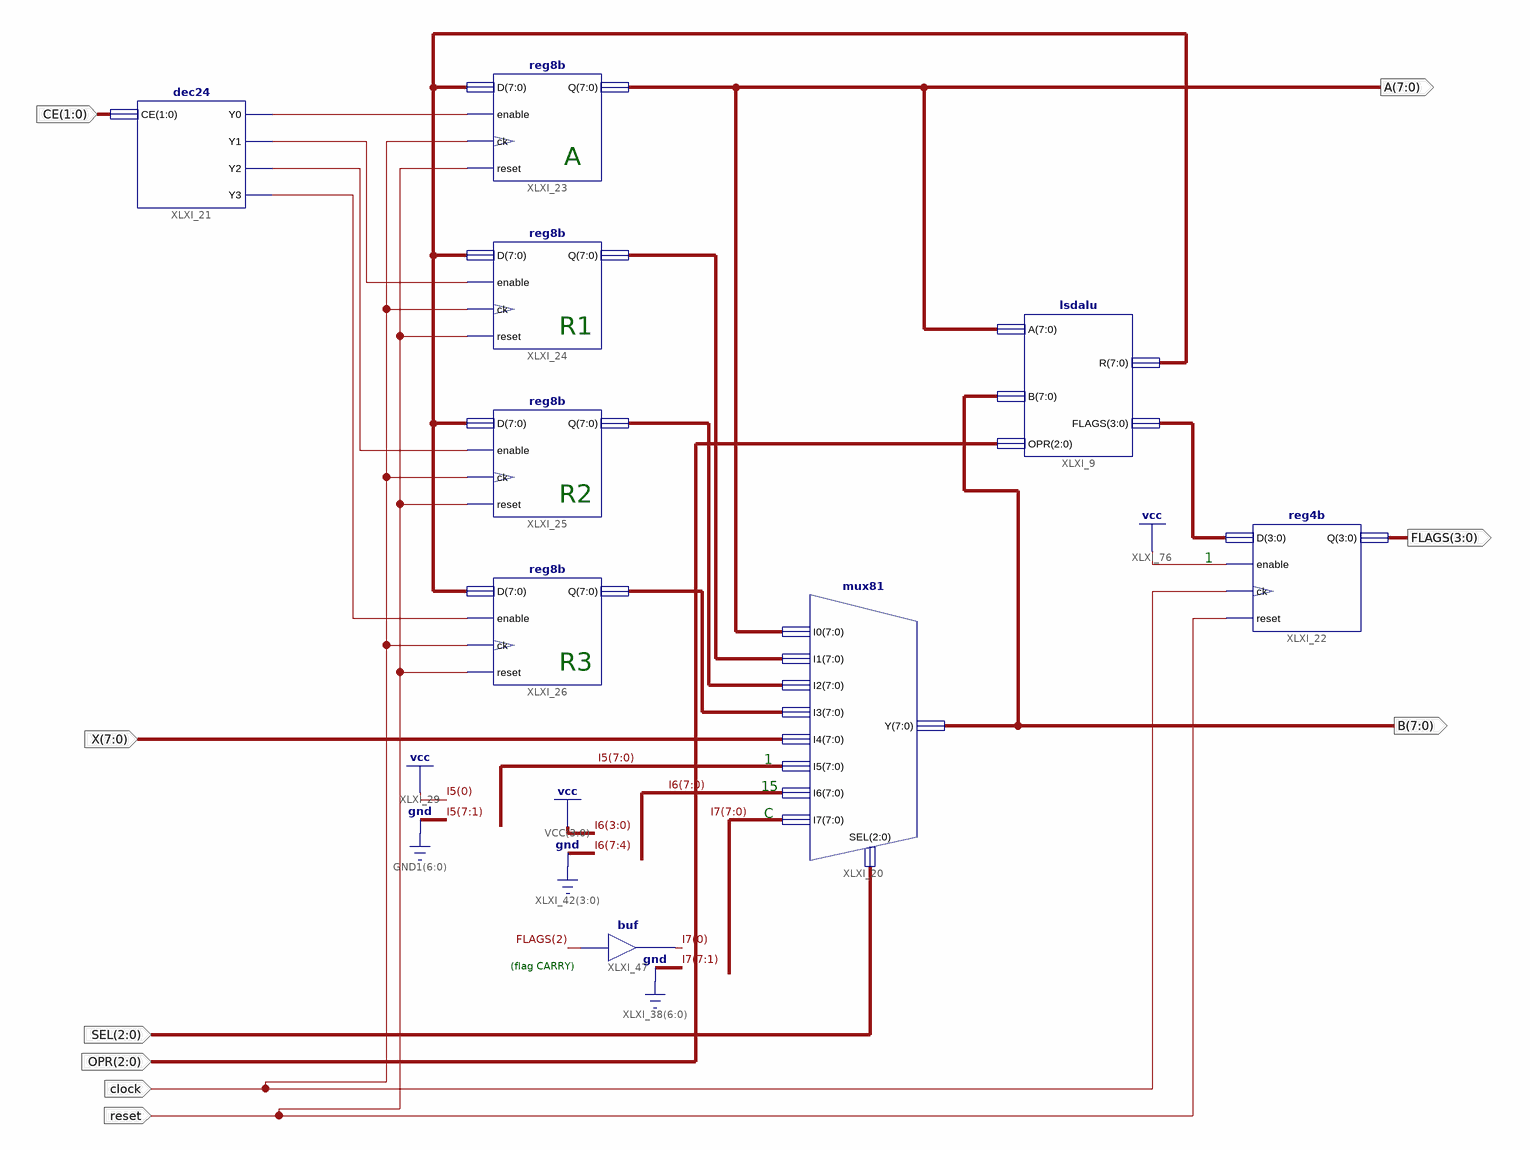
[diagram p0: schematic sheet 1]
// Xilinx ISE schematic datapath.sch (spartan3) as structural Verilog: 9 symbols, 9 ports
module datapath (
  input  [7:0] X,
  input  reset,
  input  [2:0] SEL,
  input  [1:0] CE,
  input  [2:0] OPR,
  input  clock,
  output [7:0] B,
  output [7:0] A,
  output [3:0] FLAGS
);

  wire XLXN_101, XLXN_102, XLXN_103, XLXN_104;
  wire [0:0] I7;
  wire [3:0] XLXN_106;
  wire [7:0] XLXN_6, XLXN_95, XLXN_98, XLXN_99;

  mux81 XLXI_20 (
    .I0(A), .I1(XLXN_99), .I2(XLXN_98), .I3(XLXN_95), .I4(X), .I5(8'b00000001), .I6(8'b00001111),
    .I7({{7{1'b0}}, I7[0]}), .Y(B), .SEL(SEL));
  buf XLXI_47 (I7[0], FLAGS[2]);
  reg8b XLXI_23 (.ck(clock), .reset(reset), .enable(XLXN_101), .D(XLXN_6), .Q(A));
  reg8b XLXI_24 (.ck(clock), .reset(reset), .enable(XLXN_102), .D(XLXN_6), .Q(XLXN_99));
  reg8b XLXI_25 (.ck(clock), .reset(reset), .enable(XLXN_103), .D(XLXN_6), .Q(XLXN_98));
  reg8b XLXI_26 (.ck(clock), .reset(reset), .enable(XLXN_104), .D(XLXN_6), .Q(XLXN_95));
  lsdalu XLXI_9 (.OPR(OPR), .A(A), .B(B), .R(XLXN_6), .FLAGS(XLXN_106));
  reg4b XLXI_22 (.ck(clock), .reset(reset), .enable(1'b1), .D(XLXN_106), .Q(FLAGS));
  dec24 XLXI_21 (.CE(CE), .Y3(XLXN_104), .Y0(XLXN_101), .Y1(XLXN_102), .Y2(XLXN_103));

  // Notes on the sheet:
  //   A
  //   R1
  //   R2
  //   1
  //   R3
  //   1
  //   15
  //   C
  //   (flag CARRY)
endmodule
